# EAGLE design Shutter Driver with DMUX3 (EAGLE 9.0.1)
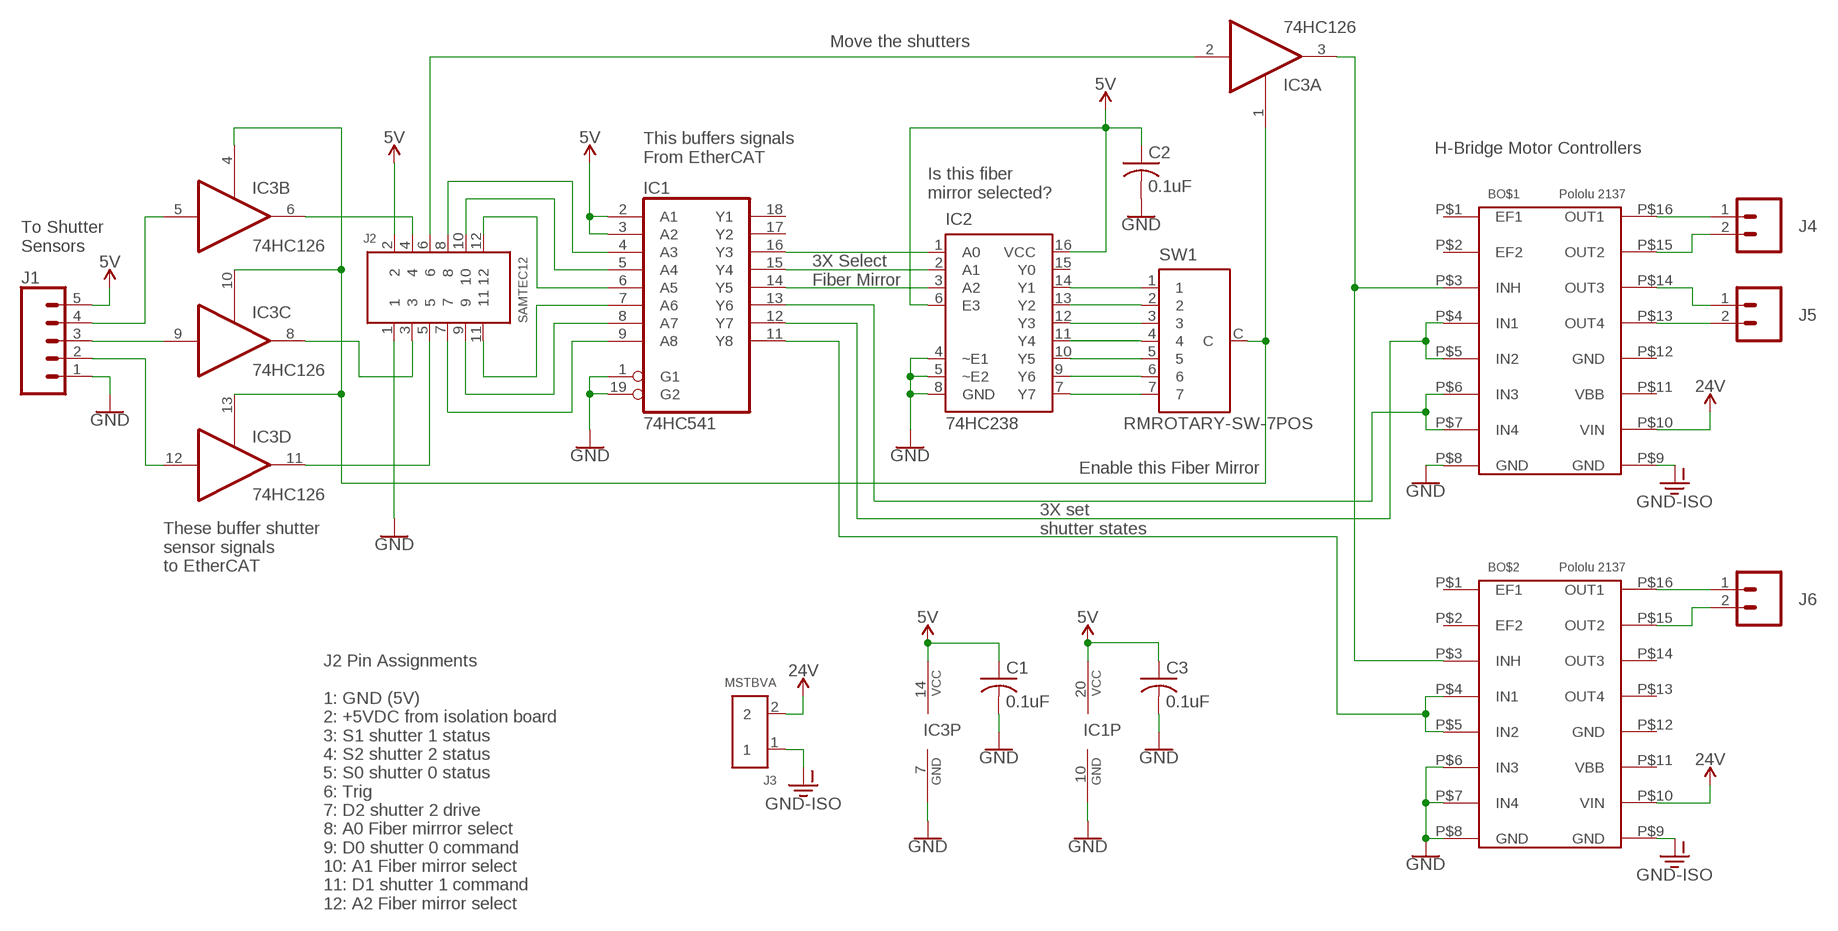
[diagram p0: schematic, sheet 1]

## Parts
BO$1  Pololu 2137  POLOLU2137  [POLOLU2137]
BO$2  Pololu 2137  POLOLU2137  [POLOLU2137]
C1  0.1uF  C-USC0805  [C0805]
C2  0.1uF  C-USC0805  [C0805]
C3  0.1uF  C-USC0805  [C0805]
IC1  74HC541  74LS541DW  [SO20W]
IC2  74HC238  [SO16]
IC3  74HC126  74LS126D  [SO14]
J1  CONN_05  [1X05]
J2  SAMTEC12  [SAMTEC12]
J3  MSTBVA  [MSTBVA]
J4  CONN_02POLAR_LOCK  [MOLEX-1X2_LOCK]
J5  CONN_02POLAR_LOCK  [MOLEX-1X2_LOCK]
J6  CONN_02POLAR_LOCK  [MOLEX-1X2_LOCK]
SW1  RMROTARY-SW-7POS  [RMROTARY-SW-7POS]

## Nets
5V: C1.1 C2.1 C3.1 IC1.2(A1) IC1.3(A2) IC1.20(VCC) IC2.6(E3) IC2.16(VCC) IC3.14(P:VCC) J1.5 J2.2
24V [power]: BO$1.P$10(VIN) BO$2.P$10(VIN) J3.2
D0: BO$1.P$4(IN1) BO$1.P$5(IN2) IC1.12(Y7)
D1: BO$1.P$6(IN3) BO$1.P$7(IN4) IC1.13(Y6)
D2: BO$2.P$4(IN1) BO$2.P$5(IN2) IC1.11(Y8)
GND: BO$1.P$8(GND) BO$2.P$6(IN3) BO$2.P$7(IN4) BO$2.P$8(GND) C1.2 C2.2 C3.2 IC1.1(G1) IC1.10(GND) IC1.19(G2) IC2.4(~E1) IC2.5(~E2) IC2.8(GND) IC3.7(P:GND) J1.1 J2.1
GND-ISO [power]: BO$1.P$9(GND) BO$2.P$9(GND) J3.1
HALL-0: IC3.12(D:I) J1.2
HALL-1: IC3.9(C:I) J1.3
HALL-2: IC3.5(B:I) J1.4
N$1 [power]: BO$1.P$13(OUT4) J5.2
N$2 [power]: BO$1.P$14(OUT3) J5.1
N$3: IC2.7(Y7) SW1.7
N$4 [power]: BO$1.P$15(OUT2) J4.2
N$5 [power]: BO$1.P$16(OUT1) J4.1
N$6: IC2.9(Y6) SW1.6
N$7: IC2.10(Y5) SW1.5
N$8: IC2.11(Y4) SW1.4
N$9: IC2.12(Y3) SW1.3
N$10: IC2.13(Y2) SW1.2
N$11 [power]: BO$2.P$15(OUT2) J6.2
N$12 [power]: BO$2.P$16(OUT1) J6.1
N$13: IC2.14(Y1) SW1.1
N$14: IC1.5(A4) J2.10
N$16: IC1.14(Y5) IC2.3(A2)
N$17: IC1.15(Y4) IC2.2(A1)
N$18: IC1.16(Y3) IC2.1(A0)
N$19: IC1.4(A3) J2.8
N$20: IC1.7(A6) J2.11
N$23: IC1.6(A5) J2.12
N$25: IC1.8(A7) J2.9
N$26: IC1.9(A8) J2.7
N$30: IC3.11(D:O) J2.5
N$31: IC3.8(C:O) J2.3
N$32: IC3.6(B:O) J2.4
N$33: IC3.2(A:I) J2.6
N$35: IC3.1(A:OE) IC3.4(B:OE) IC3.10(C:OE) IC3.13(D:OE) SW1.C
TRIG: BO$1.P$3(INH) BO$2.P$3(INH) IC3.3(A:O)
Unconnected: BO$1.P$1(EF1) BO$1.P$2(EF2) BO$1.P$11(VBB) BO$2.P$1(EF1) BO$2.P$2(EF2) BO$2.P$11(VBB) BO$2.P$13(OUT4) BO$2.P$14(OUT3) IC1.17(Y2) IC1.18(Y1) IC2.15(Y0)

## Notes on the sheet
- Move the shutters
- H-Bridge Motor Controllers
- This buffers signals
  From EtherCAT
- Is this fiber
  mirror selected?
- To Shutter
  Sensors
- 3X Select
  Fiber Mirror
- Enable this Fiber Mirror
- 3X set
  shutter states
- These buffer shutter
  sensor signals
  to EtherCAT
- J2 Pin Assignments
  
  1: GND (5V)
  2: +5VDC from isolation board
  3: S1 shutter 1 status
  4: S2 shutter 2 status
  5: S0 shutter 0 status
  6: Trig
  7: D2 shutter 2 drive
  8: A0 Fiber mirrror select
  9: D0 shutter 0 command
  10: A1 Fiber mirror select
  11: D1 shutter 1 command
  12: A2 Fiber mirror select

## Power pins joined to a net without a drawn wire
GND: BO$1.P$12(GND) BO$2.P$12(GND)

## Library data of the parts
BO$1 BO$2 = AU:POLOLU2137: Pololu item #2137 - Dual H-Bridge motor driver Details: Allegro A4990 controller DC motors 6 V to 32 V, 0.7 A each Peak current 0.9 A Inputs 3V and 5V compatible $5.95 each in November 2014 from pololu.com
C1-C3 = rcl:C-US: CAPACITOR, American symbol; SPICEPREFIX: C
IC1 = 74xx-us:74*541: Octal BUFFER and LINE DRIVER, 3-state
IC2 = AU:74HC238
IC3 = 74xx-us:74*126: Quad bus BUFFER, 3-state
J1 = SparkFun-Connectors:CONN_05: Multi connection point. Often used as Generic Header-pin footprint for 0.1 inch spaced/style header connections On any of the 0.1 inch spaced packages, you can populate with these: Break Away Headers - Straight <https://www.sparkfun.com/products/116> (PRT-00116) Break Away Male Headers - Right Angle <https://www.sparkfun.com/products/553> (PRT-00553) Female Headers <https://www.sparkfun.com/products/115> (PRT-00115) Break Away Headers - Machine Pin <https://www.sparkfun.com/products/117> (PRT-00117) Break Away Female Headers - Swiss Machine Pin <https://www.sparkfun.com/products/743> (PRT-00743) For SCREWTERMINALS and SPRING TERMINALS visit here: Screw Terimnals on SparkFun.com <https://www.sparkfun.com/search/results?term=Screw+Terminals> (5mm/3.5mm/2.54mm spacing) This device is also useful as a general connection point to wire up your design to another part of your project. Our various solder wires solder well into these plated through hole pads. Hook-Up Wire - Assortment (Stranded, 22 AWG) <https://www.sparkfun.com/products/11375> (PRT-11375) Hook-Up Wire - Assortment (Solid Core, 22 AWG) <https://www.sparkfun.com/products/11367> (PRT-11367) View the entire wire category on our website here <https://www.sparkfun.com/categories/141> Special notes: Molex polarized connector foot print use with SKU : PRT-08231 with associated crimp pins and housings. 1MM SMD Version SKU: PRT-10208
J2 = AU:SAMTEC12
J3 = AU:MSTBVA: Phoenix Contact MSTBVA Vertical Terminal Block Phoenix order number 1755736 Digikey: 277-1150-ND Mating part is Phoneix Contact Combicon Spring Cage plug TFCK 5.08 mm pitch Digikey: 277-6941-ND
J4-J6 = SparkFun-Connectors:CONN_02: Multi connection point. Often used as Generic Header-pin footprint for 0.1 inch spaced/style header connections On any of the 0.1 inch spaced packages, you can populate with these: Break Away Headers - Straight <https://www.sparkfun.com/products/116> (PRT-00116) Break Away Male Headers - Right Angle <https://www.sparkfun.com/products/553> (PRT-00553) Female Headers <https://www.sparkfun.com/products/115> (PRT-00115) Break Away Headers - Machine Pin <https://www.sparkfun.com/products/117> (PRT-00117) Break Away Female Headers - Swiss Machine Pin <https://www.sparkfun.com/products/743> (PRT-00743) For SCREWTERMINALS and SPRING TERMINALS visit here: Screw Terimnals on SparkFun.com <https://www.sparkfun.com/search/results?term=Screw+Terminals> (5mm/3.5mm/2.54mm spacing) This device is also useful as a general connection point to wire up your design to another part of your project. Our various solder wires solder well into these plated through hole pads. Hook-Up Wire - Assortment (Stranded, 22 AWG) <https://www.sparkfun.com/products/11375> (PRT-11375) Hook-Up Wire - Assortment (Solid Core, 22 AWG) <https://www.sparkfun.com/products/11367> (PRT-11367) View the entire wire category on our website here <https://www.sparkfun.com/categories/141> Special notes: Molex polarized connector foot print use with: PRT-08233 with associated crimp pins and housings. 2.54_SCREWTERM for use with PRT-10571. 3.5mm Screw Terminal footprints for PRT-08084 5mm Screw Terminal footprints for use with PRT-08432; SF_ID: PRT-09918
SW1 = AU:RMROTARY-SW-7POS

## Net classes
1 power: width 0.305 mm, drill 0.635 mm, clearance 0.381 mm

## Board
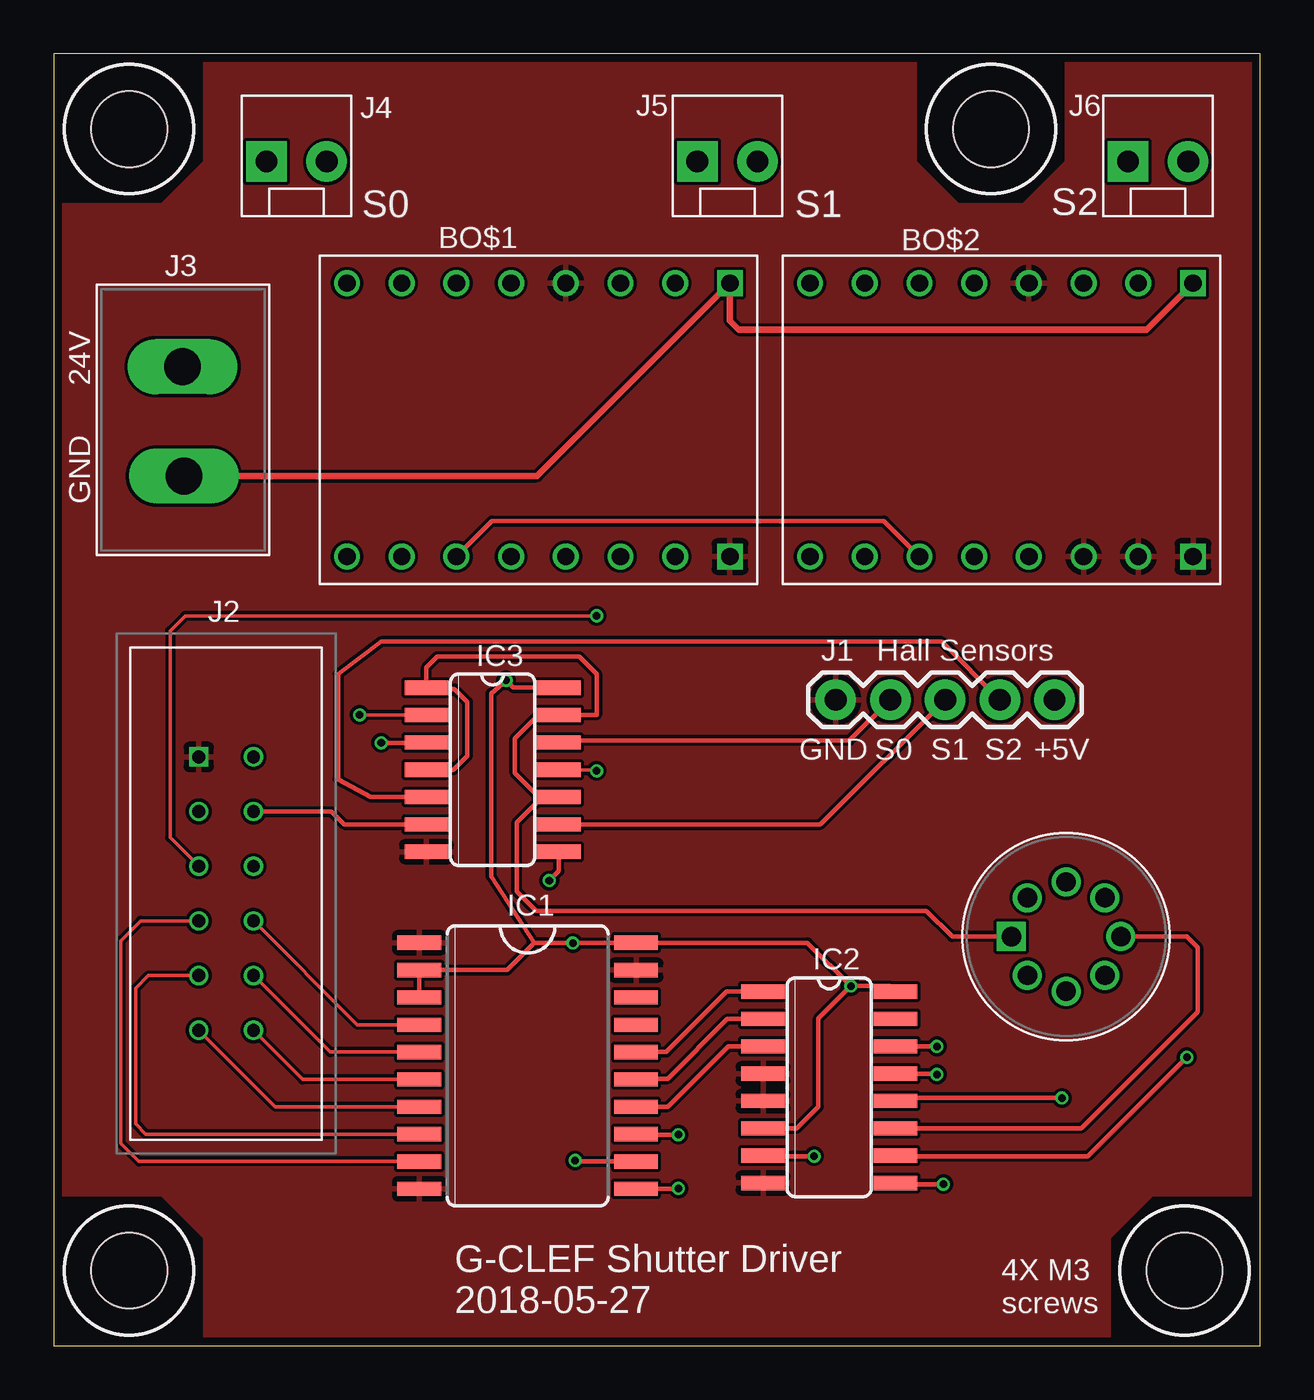
[diagram p1: board, top side]
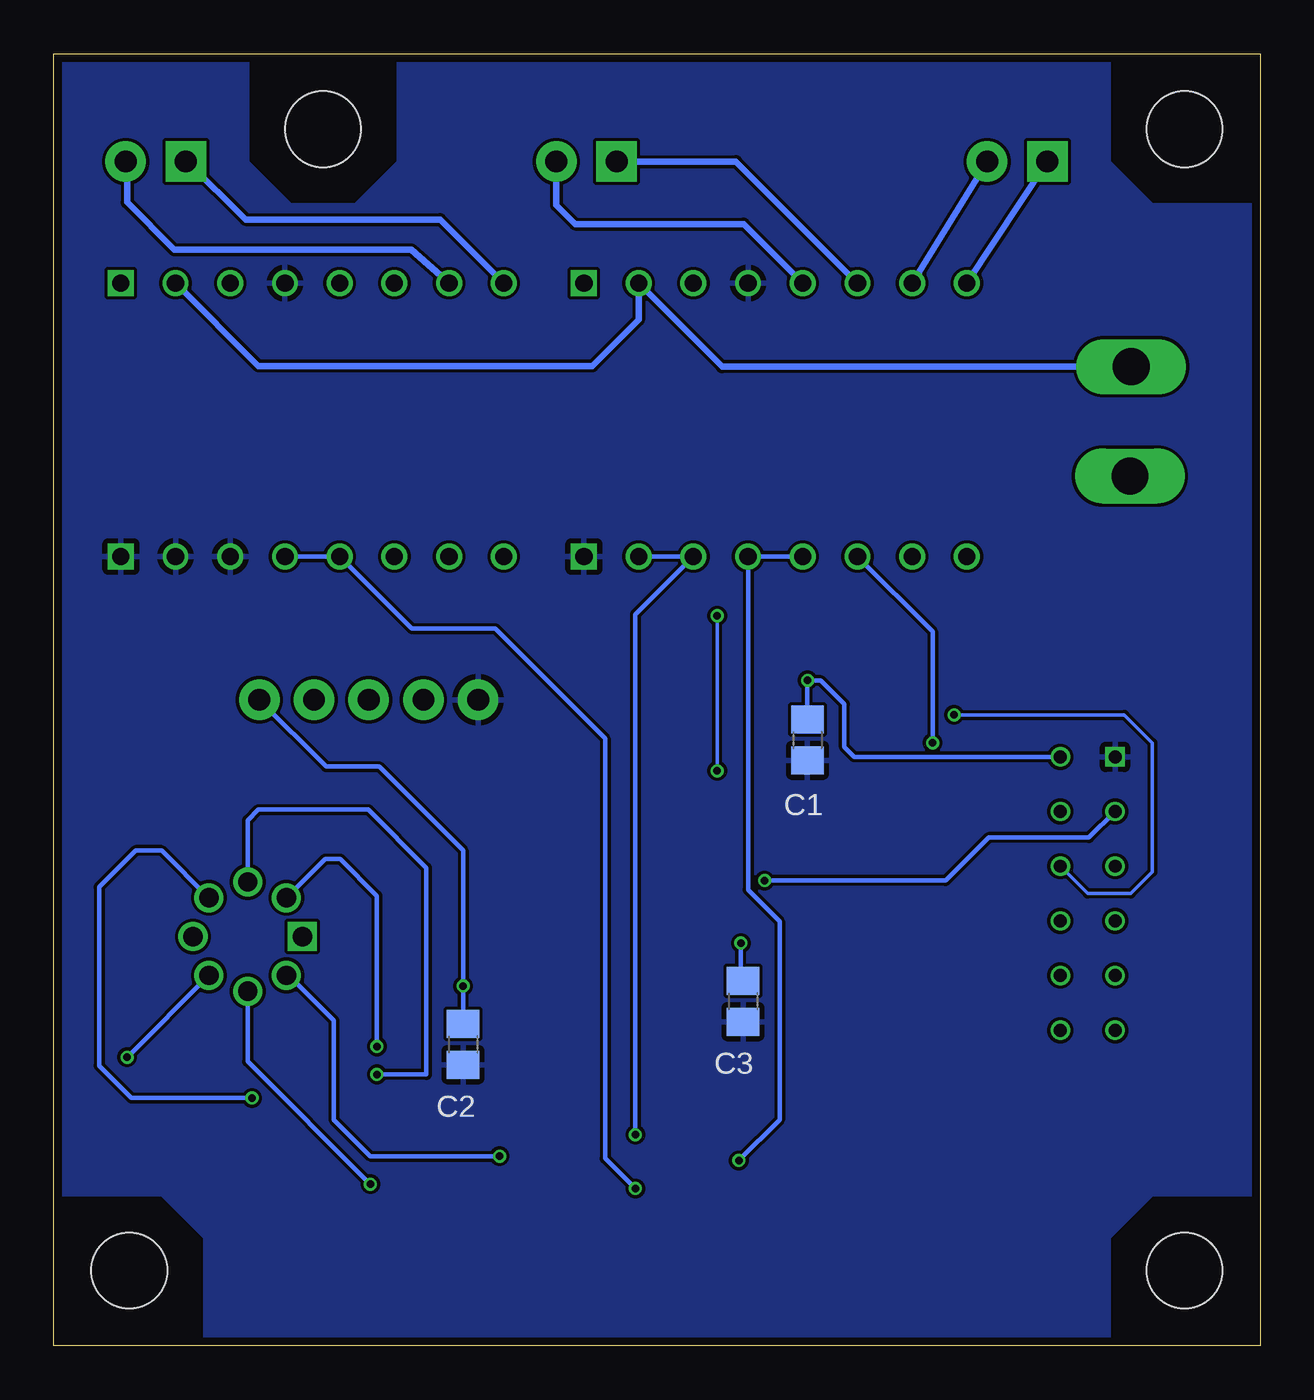
[diagram p2: board, bottom side, seen from below]

Size 56 x 60 mm. Coordinates in mm from the lower left corner, seen from the top.
Outline: 0,0 56,0 56,60 0,60 0,0
Copper layers (1*16): Top 0.035559375mm / dielectric 1.6mm / Bottom 0.035559375mm
Design rules "oshpark-2layer": minimum track width 6mil, minimum drill 10mil, track to track 6mil, track to pad 6mil, pad to pad 6mil, via to via 6mil, smd to smd 6mil, copper to edge 15mil, drill to drill 6mil, minimum pad ring 5mil, minimum via ring 5mil, stop-mask expansion 2.5mil, vias tented up to drill 0mil, thermal gap 10mil
Holes 3.5 mm at 3.5,3.5 52.5,3.5 3.5,56.5 43.5,56.5

### Footprints (pad centres in the part's own frame; a part is rotated, then mirrored left to right if it is on the bottom)
POLOLU2137 = drill 0.8: P$1 -6.35,8.89; P$2 -6.35,6.35; P$3 -6.35,3.81; P$4 -6.35,1.27; P$5 -6.35,-1.27; P$6 -6.35,-3.81; P$7 -6.35,-6.35; P$10 6.35,-6.35; P$11 6.35,-3.81; P$12 6.35,-1.27; P$13 6.35,1.27; P$14 6.35,3.81; P$15 6.35,6.35; P$16 6.35,8.89 | drill 0.8 square: P$8 -6.35,-8.89; P$9 6.35,-8.89
C0805 = smd 1.3 x 1.5: 1 -0.95,0; 2 0.95,0
SO20W = smd 0.66 x 2.032: 1 -5.715,-5.029; 2 -4.445,-5.029; 3 -3.175,-5.029; 4 -1.905,-5.029; 5 -0.635,-5.029; 6 0.635,-5.029; 7 1.905,-5.029; 8 3.175,-5.029; 9 4.445,-5.029; 10 5.715,-5.029; 11 5.715,5.029; 12 4.445,5.029; 13 3.175,5.029; 14 1.905,5.029; 15 0.635,5.029; 16 -0.635,5.029; 17 -1.905,5.029; 18 -3.175,5.029; 19 -4.445,5.029; 20 -5.715,5.029
SO16 = smd 0.66 x 2.032: 1 -4.445,-3.073; 2 -3.175,-3.073; 3 -1.905,-3.073; 4 -0.635,-3.073; 5 0.635,-3.073; 6 1.905,-3.073; 7 3.175,-3.073; 8 4.445,-3.073; 9 4.445,3.073; 10 3.175,3.073; 11 1.905,3.073; 12 0.635,3.073; 13 -0.635,3.073; 14 -1.905,3.073; 15 -3.175,3.073; 16 -4.445,3.073
SO14 = smd 0.66 x 2.032: 1 -3.81,-3.073; 2 -2.54,-3.073; 3 -1.27,-3.073; 4 0,-3.073; 5 1.27,-3.073; 6 2.54,-3.073; 7 3.81,-3.073; 8 3.81,3.073; 9 2.54,3.073; 10 1.27,3.073; 11 0,3.073; 12 -1.27,3.073; 13 -2.54,3.073; 14 -3.81,3.073
1X05 = drill 1.016 pad 1.88: 1 0,0; 2 2.54,0; 3 5.08,0; 4 7.62,0; 5 10.16,0
SAMTEC12 = drill 0.6 square: 1 -1.27,6.35 | drill 0.6: 2 1.27,6.35; 3 -1.27,3.81; 4 1.27,3.81; 5 -1.27,1.27; 6 1.27,1.27; 7 -1.27,-1.27; 8 1.27,-1.27; 9 -1.27,-3.81; 10 1.27,-3.81; 11 -1.27,-6.35; 12 1.27,-6.35
MSTBVA = drill 1.7 long: 1 -2.61,-0.04; 2 2.47,0.02
MOLEX-1X2_LOCK = drill 1.016 pad 1.88 square: 1 -0.127,0 | drill 1.016 pad 1.88: 2 2.667,0
RMROTARY-SW-7POS = drill 0.9: 1 1.8,1.8; 2 2.54,0; 3 1.8,-1.8; 4 0,-2.54; 5 -1.8,-1.8; 6 -2.54,0; 7 -1.8,1.8 | drill 0.9 square: C 0,2.54

### Placement (x,y rotation side)
BO$1  22.5,43 90 top
BO$2  44,43 90 top
C1  21.01,28.13 270 bottom
C2  37,14 270 bottom
C3  24,16 270 bottom
IC1  22,13 270 top
IC2  36,12 270 top
IC3  20.37,26.75 270 top
J1  36.3,30 0 top
J2  8,21 0 top
J3  6,43 90 top
J4  10,55 0 top
J5  30,55 0 top
J6  50,55 0 top
SW1  47,19 90 top

### Tracks (layer width: path | path; a pad name or v marks a point on that pad's centre or on a via)
5V  (via drill 0.35)
  Top 0.2: IC2.16 38.82,16.7 v37,16.7 | IC3.14 21.34,30.56 v21,30.9 20.3,30.3 20.3,21.8 22.3,18.7 | IC2.6 34.5,10.1 35.5,11.1 35.5,15.2 v37,16.7 | 22.3,18.7 v24.1,18.7 24.11,18.71 IC1.20 34.98,18.71 v37,16.7 | IC1.3 IC1.2 21.05,17.45 22.3,18.7
  Bottom 0.2: C2.1 v37,16.7 37,23 40.9,26.9 43.36,26.9 J1.5 | C1.1 v21.01,30.89 | v21.01,30.89 v21,30.9 | C3.1 24.1,17.05 v24.1,18.7 | J2.2 18.85,27.35 19.3,27.8 19.3,29.8 20.39,30.89 v21.01,30.89
24V
  Bottom 0.305: J3.2 24.97,45.47 BO$1.P$10 28.85,47.65 31,45.5 46.5,45.5 BO$2.P$10
D0  (via drill 0.35)
  Top 0.2: v24.2,8.6 24.25,8.55 IC1.12
  Bottom 0.2: BO$1.P$4 BO$1.P$5 23.77,21.17 22.3,19.7 22.3,10.5 v24.2,8.6
D1  (via drill 0.35)
  Top 0.2: v29,9.8 27.05,9.8 IC1.13
  Bottom 0.2: v29,9.8 29,33.96 BO$1.P$6 BO$1.P$7
D2  (via drill 0.35)
  Top 0.2: v29,7.3 28.98,7.29 IC1.11
  Bottom 0.2: BO$2.P$5 BO$2.P$4 39.38,33.3 35.5,33.3 30.4,28.2 30.4,8.7 v29,7.3
GND
  pour Top: 0,53 5,53 7,55 7,60 40,60 40,55 42,53 45,53 47,55 47,60 56,60 56,7 51,7 49,5 49,0 7,0 7,5 5,7 0,7
  pour Bottom: 7,60 40,60 40,55 42,53 45,53 47,55 47,60 56,60 56,7 51,7 49,5 49,0 7,0 7,5 6,6 5,7 0,7 0,53 5,53 7,55
GND-ISO
  Top 0.305: J3.1 22.43,40.39 BO$1.P$9 31.39,47.61 31.8,47.2 50.74,47.2 BO$2.P$9
HALL-0
  Top 0.2: IC3.12 23.46,28 23.56,28.1 36.94,28.1 J1.2
HALL-1
  Top 0.2: IC3.9 35.59,24.21 J1.3
HALL-2
  Top 0.2: J1.4 41.22,32.7 15.2,32.7 13.2,31.2 13.2,26.3 14.72,25.48 IC3.5
N$1
  Bottom 0.305: J5.2 32.67,52.97 31.8,52.1 23.98,52.1 BO$1.P$13
N$2
  Bottom 0.305: J5.1 24.34,55 BO$1.P$14
N$3  (via drill 0.35)
  Top 0.2: v35.3,8.8 32.95,8.8 IC2.7
  Bottom 0.2: SW1.7 45.1,17.2 43,15.1 43,10.5 41.3,8.8 v35.3,8.8
N$4
  Bottom 0.305: J4.2 BO$1.P$15
N$5
  Bottom 0.305: J4.1 BO$1.P$16
N$6  (via drill 0.35)
  Top 0.2: IC2.9 39.12,7.6 39.22,7.5 v41.3,7.5
  Bottom 0.2: SW1.6 47,13.2 v41.3,7.5
N$7  (via drill 0.35)
  Top 0.2: IC2.10 39.1,8.8 48,8.8 v52.6,13.4
  Bottom 0.2: SW1.5 v52.6,13.4
N$8
  Top 0.2: SW1.4 52.6,19 53.1,18.5 53.1,15.5 47.7,10.1 IC2.11
N$9  (via drill 0.35)
  Top 0.2: v46.8,11.5 39.21,11.5 IC2.12
  Bottom 0.2: SW1.3 51,23 52.2,23 53.9,21.3 53.9,13 52.4,11.5 v46.8,11.5
N$10  (via drill 0.35)
  Top 0.2: v41,12.6 40.97,12.63 IC2.13
  Bottom 0.2: SW1.2 47,24.4 46.5,24.9 41.4,24.9 38.7,22.2 38.7,12.6 v41,12.6
N$11
  Bottom 0.305: J6.2 52.6,54.93 52.6,53.1 50.4,50.9 39.4,50.9 BO$2.P$15
N$12
  Bottom 0.305: J6.1 49.8,55 47.1,52.3 38.06,52.3 BO$2.P$16
N$13  (via drill 0.35)
  Top 0.2: v41,13.9 IC2.14
  Bottom 0.2: SW1.1 43.4,22.6 42.7,22.6 41,20.9 v41,13.9
N$14
  Top 0.152: IC1.5 12.82,13.63 J2.10
N$16
  Top 0.2: IC1.14 28.5,11.1 31.3,13.9 IC2.3
N$17
  Top 0.2: IC1.15 27.06,12.4 28.5,12.4 31.27,15.18 IC2.2
N$18
  Top 0.2: IC1.16 28.43,13.63 31.25,16.45 IC2.1
N$19
  Top 0.152: IC1.4 14.1,14.9 J2.8
N$20
  Top 0.152: IC1.7 10.29,11.1 J2.11
N$23
  Top 0.152: IC1.6 11.55,12.37 J2.12
N$25
  Top 0.152: IC1.8 4.28,9.82 3.8,10.3 3.8,16.6 4.39,17.19 J2.9
N$26
  Top 0.152: IC1.9 3.94,8.55 3.1,9.4 3.1,18.8 4.03,19.73 J2.7
N$30  (via drill 0.35)
  Top 0.152: IC3.11 25.15,26.75 v25.2,26.7 | v25.2,33.9 6.1,33.9 5.4,33.2 5.4,23.6 J2.5
  Bottom 0.152: v25.2,26.7 v25.2,33.9
N$31  (via drill 0.35)
  Top 0.2: v23,21.6 23.44,22.04 IC3.8
  Bottom 0.2: J2.3 7.94,23.6 12.6,23.6 14.6,21.6 v23,21.6
N$32
  Top 0.2: J2.4 12.89,24.81 13.49,24.21 IC3.6
N$33  (via drill 0.35)
  Top 0.152: IC3.2 v14.21,29.29 v14.2,29.3
  Bottom 0.152: v14.2,29.3 6.3,29.3 5,28 5,22 6,21 8,21 J2.6
N$35
  Top 0.2: SW1.C 41.7,19 40.5,20.2 22.4,20.2 21.5,21.1 21.5,24.3 22.68,25.48 IC3.10 22.52,25.48 21.4,26.6 21.4,28.2 22.6,29.4 22.71,29.29 IC3.13 23.45,29.3 25.2,29.3 25.2,31.2 24.4,32 17.8,32 17.3,31.5 IC3.1 17.36,30.5 18.6,30.5 19.2,29.9 19.2,27.4 18.55,26.75 IC3.4
TRIG  (via drill 0.35)
  Top 0.2: BO$1.P$3 20.34,38.3 38.54,38.3 BO$2.P$3 | v15.2,28 17.28,28 IC3.3
  Bottom 0.2: BO$1.P$3 15.2,33.16 v15.2,28

### Text on the board
tPlace: S0 | S1 | S2 | 24V | GND | Hall Sensors | GND | S0 | S1 | S2 | +5V | G-CLEF Shutter Driver / 2018-05-27 | 4X M3 / screws